# Altium project MLX90393_demo.PrjPcb
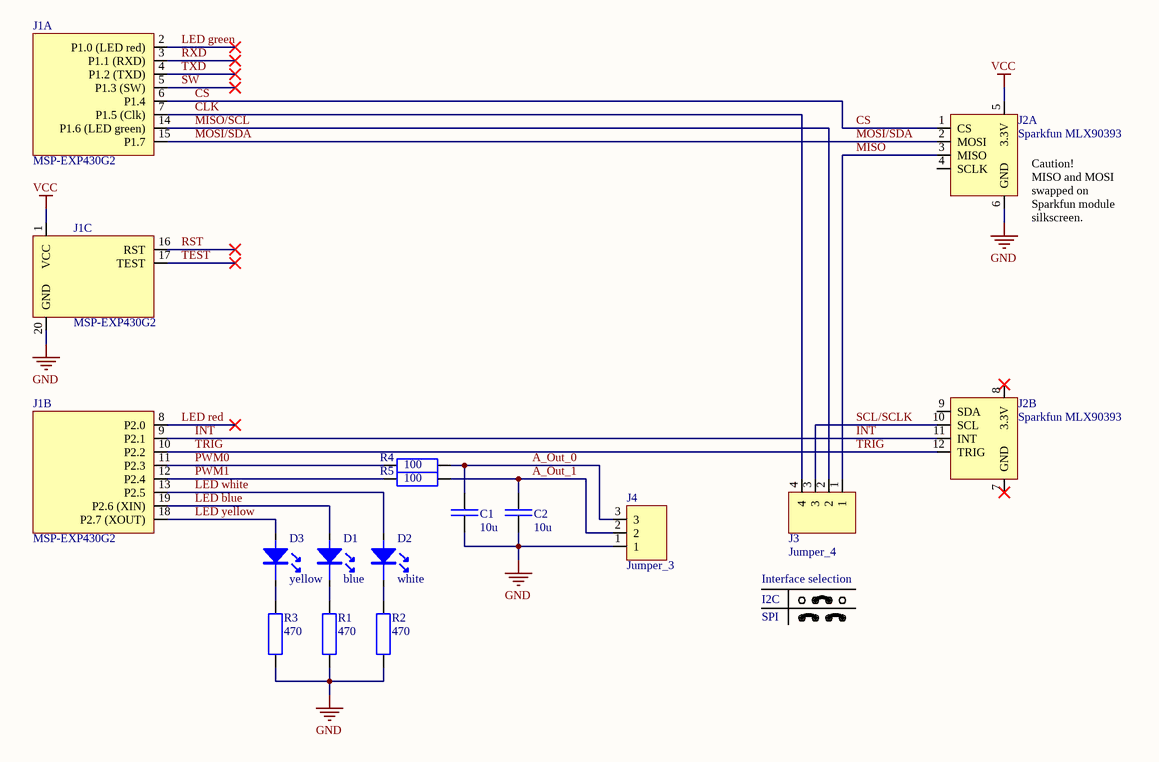
[diagram p0: MLX90393_demo.SchDoc]
1 sheet, 14 parts. Net scope: global (net labels, ports and power ports of the same name join across sheets).
Board file: MLX90393_demo.PcbDoc

## Sheet MLX90393_demo.SchDoc
size A4

### Parts
C1  10u  [C_0603_S]
C2  10u  [C_0603_S]
D1  blue  [LED_0603_S_BLUE]
D2  white  [LED_0603_S]
D3  yellow  [LED_0603_S_YELLOW]
J1  MSP-EXP430G2  [MSP-EXP430G2]  (parts A,B,C of 3)
J2  Sparkfun MLX90393  [Sparkfun MLX90393]  (parts A,B of 2)
J3  Jumper_4  [Jumper_4]
J4  Jumper_3  [Jumper_3]
R1  470  [R_conv_400mil]
R2  470  [R_conv_400mil]
R3  470  [R_conv_400mil]
R4  100  [R_conv_400mil]
R5  100  [R_conv_400mil]

### Nets
GND: C1.2 C2.2 J1.20(GND) J2.6(GND) J4.1 R1.2 R2.2 R3.2
VCC: J1.1(VCC) J2.5(3.3V)
A_Out_0: C1.1 J4.3 R4.2
A_Out_1: C2.1 J4.2 R5.2
CLK: J1.7(P1.5_(Clk)) J3.4
CS: J1.6(P1.4) J2.1(CS)
INT: J1.9(P2.1) J2.11(INT)
LED blue: D1.A J1.19(P2.6_(XIN))
LED green: J1.2(P1.0_(LED_red))
LED red: J1.8(P2.0)
LED white: D2.A J1.13(P2.5)
LED yellow: D3.A J1.18(P2.7_(XOUT))
MISO: J2.3(MISO) J3.1
MISO/SCL: J1.14(P1.6_(LED_green)) J3.2
MOSI/SDA: J1.15(P1.7) J2.2(MOSI)
PWM0: J1.11(P2.3) R4.1
PWM1: J1.12(P2.4) R5.1
RST: J1.16(RST)
RXD: J1.3(P1.1_(RXD))
SCL/SCLK: J2.10(SCL) J3.3
SW: J1.5(P1.3_(SW))
TEST: J1.17(TEST)
TRIG: J1.10(P2.2) J2.12(TRIG)
TXD: J1.4(P1.2_(TXD))
NetD1_K: D1.K R1.1
NetD2_K: D2.K R2.1
NetD3_K: D3.K R3.1

Not connected (* = marked no-connect by the designer): J2 4(SCLK) 7(GND)* 8(3.3V)* 9(SDA)

### Notes on the sheet
- (near J2) Caution!
  MISO and MOSI
  swapped on
  Sparkfun module
  silkscreen.
- Interface selection
- I2C
- SPI

### Library data of the parts
C1 C2 = C
D1-D3 = LED
R1-R5 = R: Normaler Widerstand